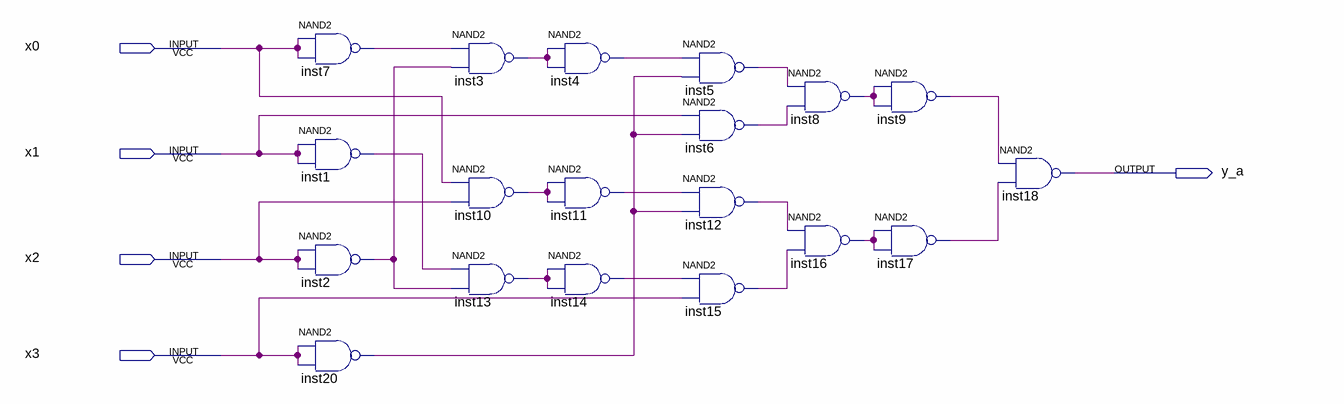
[diagram p0: schematic sheet]
// Quartus schematic y_a.bdf as structural Verilog: 19 symbols, 5 pins
module y_a (
  input  x0,
  input  x1,
  input  x2,
  input  x3,
  output y_a
);

  wire inst1_out, inst2_out, inst3_out, inst4_out, inst5_out, inst6_out, inst7_out, inst8_out, inst9_out,
       inst10_out, inst11_out, inst12_out, inst13_out, inst14_out, inst15_out, inst16_out, inst17_out,
       inst20_out;

  nand inst7 (inst7_out, x0, x0);
  nand inst1 (inst1_out, x1, x1);
  nand inst2 (inst2_out, x2, x2);
  nand inst20 (inst20_out, x3, x3);
  nand inst3 (inst3_out, inst7_out, inst2_out);
  nand inst10 (inst10_out, x0, x2);
  nand inst13 (inst13_out, inst1_out, inst2_out);
  nand inst4 (inst4_out, inst3_out, inst3_out);
  nand inst11 (inst11_out, inst10_out, inst10_out);
  nand inst14 (inst14_out, inst13_out, inst13_out);
  nand inst5 (inst5_out, inst4_out, inst20_out);
  nand inst6 (inst6_out, x1, inst20_out);
  nand inst12 (inst12_out, inst11_out, inst20_out);
  nand inst15 (inst15_out, inst14_out, x3);
  nand inst8 (inst8_out, inst5_out, inst6_out);
  nand inst16 (inst16_out, inst12_out, inst15_out);
  nand inst9 (inst9_out, inst8_out, inst8_out);
  nand inst17 (inst17_out, inst16_out, inst16_out);
  nand inst18 (y_a, inst9_out, inst17_out);
endmodule
